# EasyEDA Pro project LED显示屏驱动.eprj

# Schematic Schematic1
Create Date: 2022-10-27; Project Name: LED显示屏驱动; Schematic Name: Schematic1; Update Date: 2022-11-05
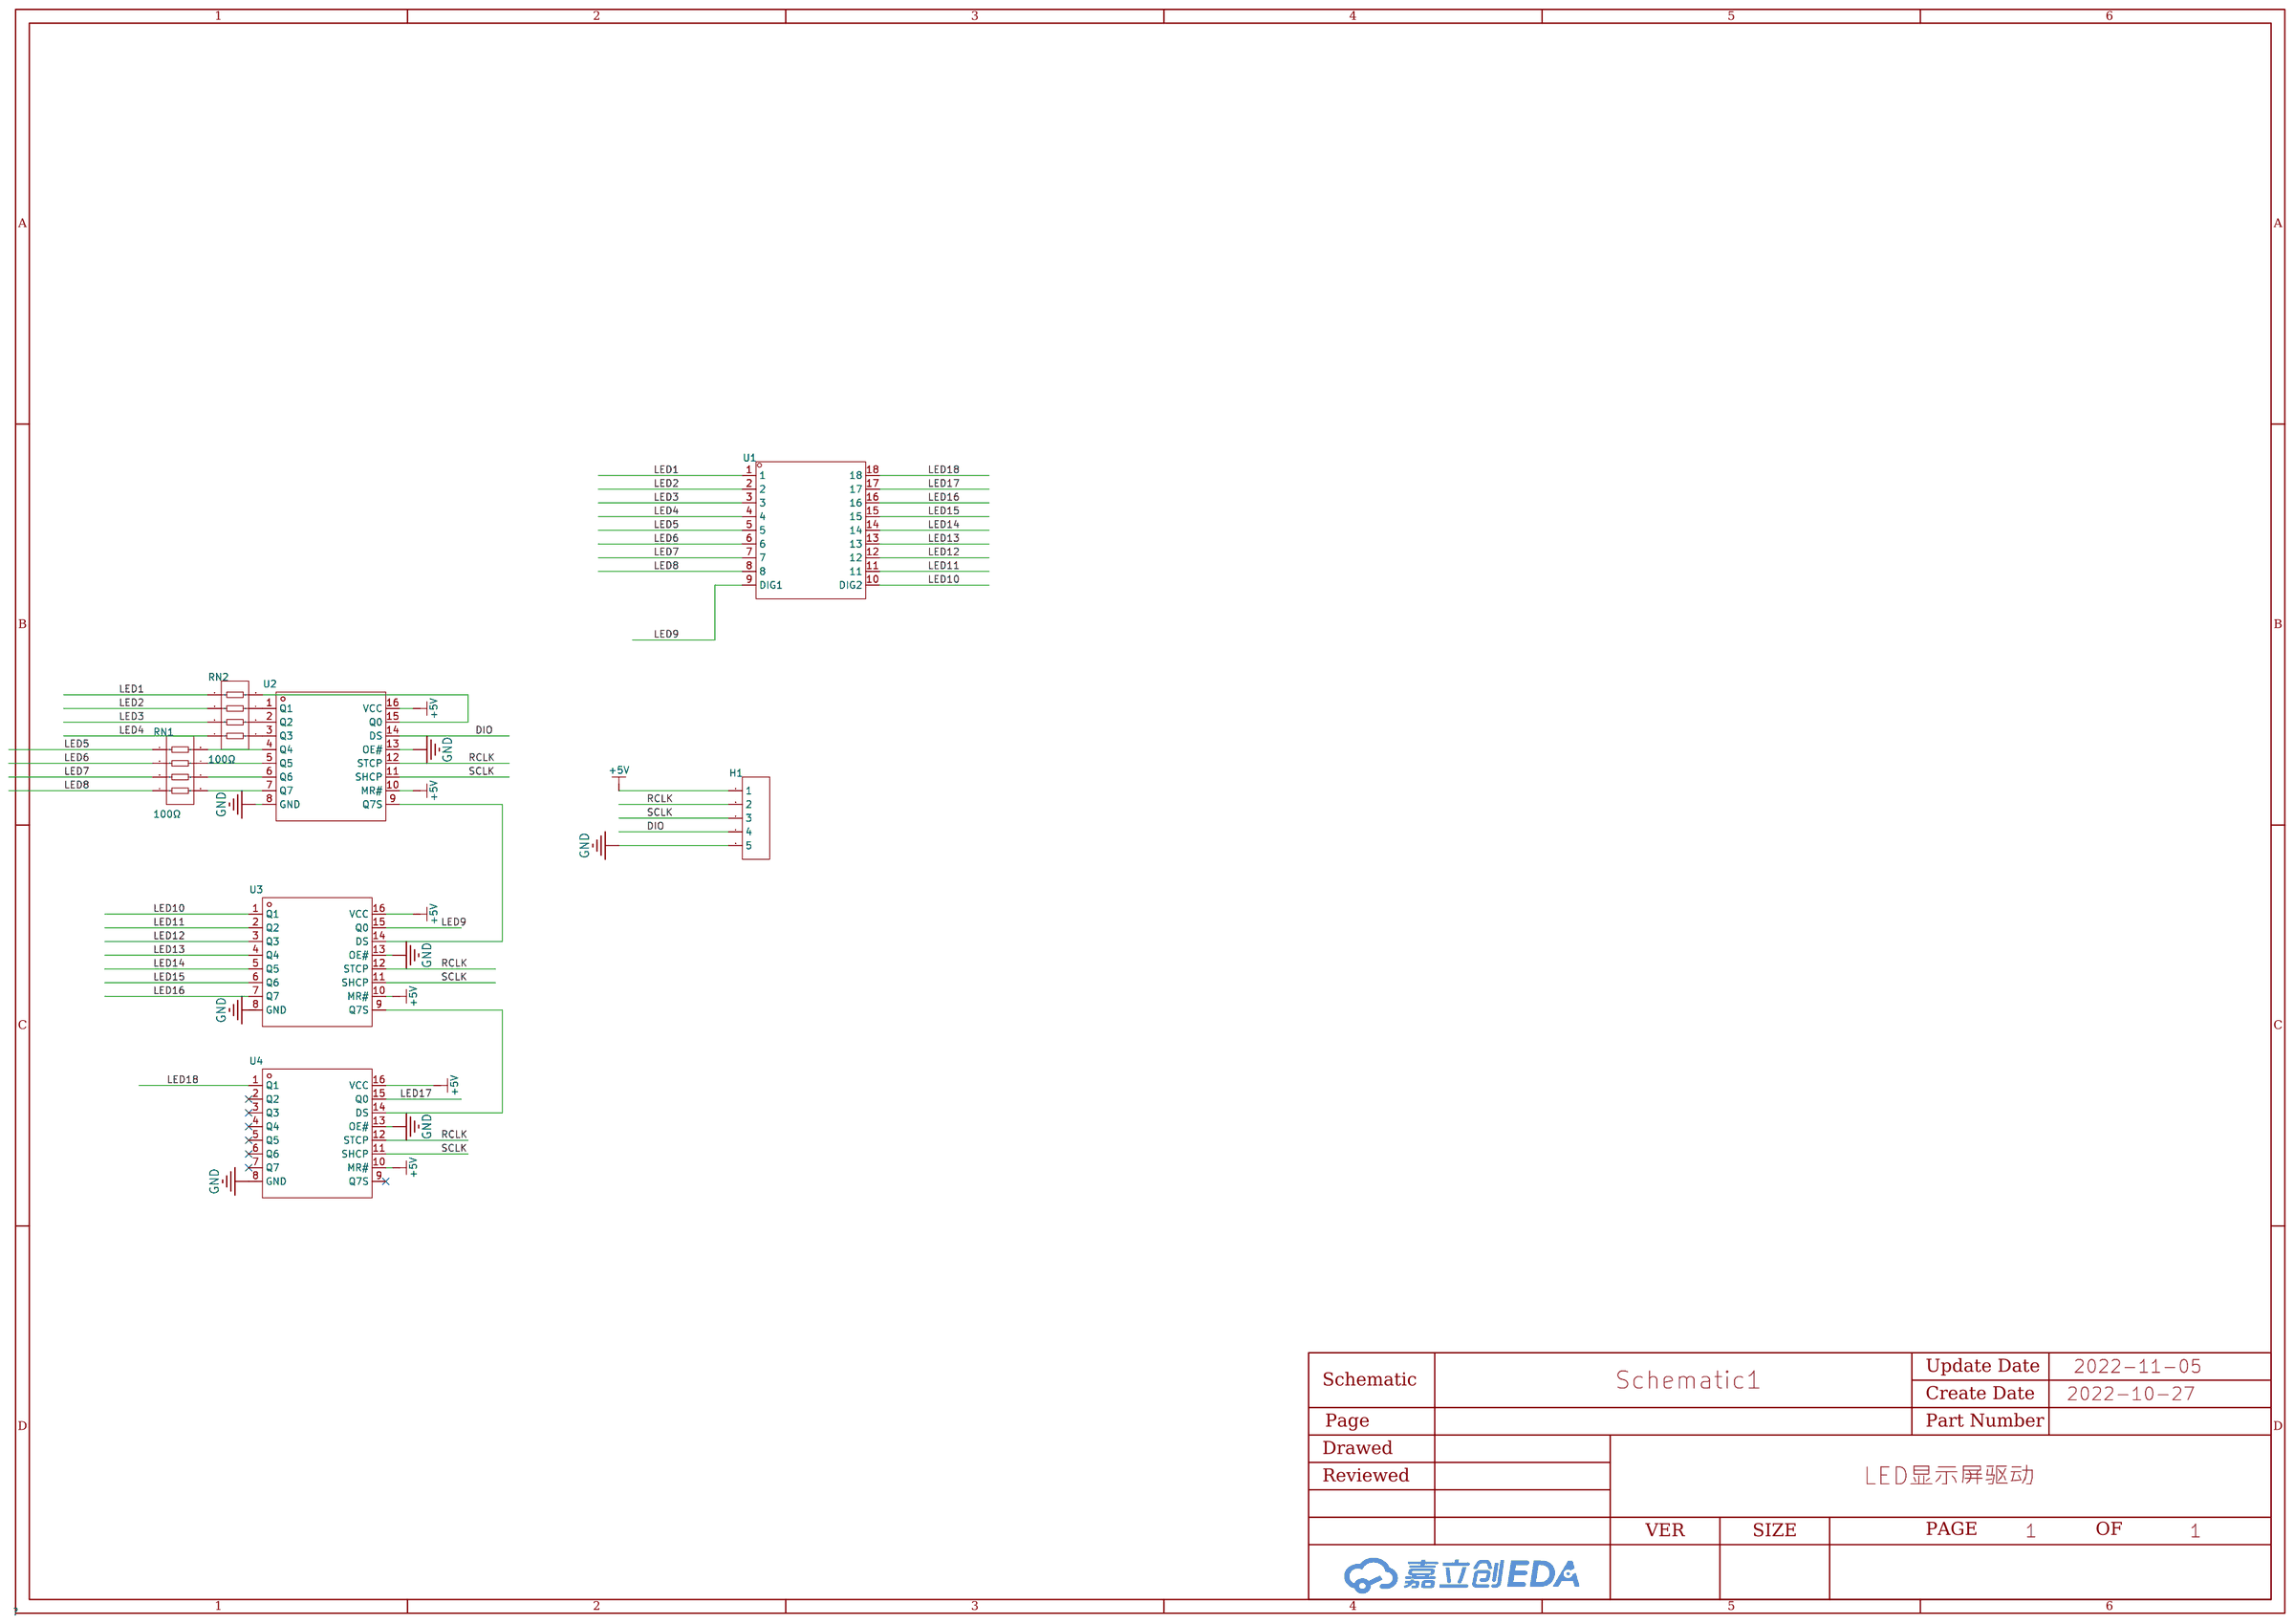
[diagram p0: schematic sheet]

## Parts
H1  2.54-1*5P母  [HDR-TH_5P-P2.54-V-F]
RN1  100Ω  [RES-ARRAY-SMD_0603-8P-L3.2-W1.6]
RN2  100Ω  [RES-ARRAY-SMD_0603-8P-L3.2-W1.6]
U1  TOD-6281AMA-B4  [LED-SEG-TH_18P-L94.0-W36.0-P2.54-S30.5-BL]
U2  74HC595S16-13  [SOIC-16_L10.8-W4.5-P1.27-LS6.8-BL]
U3  74HC595S16-13  [SOIC-16_L10.8-W4.5-P1.27-LS6.8-BL]
U4  74HC595S16-13  [SOIC-16_L10.8-W4.5-P1.27-LS6.8-BL]

## Library data of the parts
H1 = 2.54-1*5P母: 间距:2.54mm;总孔位数:5;排数:1;插孔结构:1x5P;行距:-;安装类型:直插;塑高:-;触头材质:-;触头镀层:-;; LCSC Part Name: 2.54mm 1x5P; Supplier Part: C50950; Manufacturer: BOOMELE(博穆精密); Supplier Footprint: 直插,P=2.54mm; JLCPCB Part Class: Extended Part; Datasheet: https://atta.szlcsc.com/upload/public/pdf/source/20151109/1457707571406.pdf; Supplier: LCSC; Pitch: 2.54mm; Number of Holes: 5; Number of Rows: 1; Holes Structure: 1x5P; Mounting Type: 直插
RN1 RN2 = 4D03WAJ0914T5E: 阻值:910kΩ;精度:±5%;单个元件功率:100mW;温度系数:±200ppm/℃;电阻器数:4;引脚数:8;; LCSC Part Name: 910kΩ ±5%; Supplier Part: C2769791; Manufacturer: UNI-ROYAL(厚声); Supplier Footprint: 0603x4; JLCPCB Part Class: Extended Part; Datasheet: https://atta.szlcsc.com/upload/public/pdf/source/20210330/C2758625_90D19EEA9B8C23AA9BAF71D52BD1DB3E.pdf; Supplier: LCSC; Tolerance: ±5%; Power(Watts): 100mW; Temperature Coefficient: ±200ppm/℃; Number of Resistors: 4; Number of Pins: 8
U1 = TOD-6281AMA-B4: 数码管位数:-;数码管的显示尺寸:-;电路连线类型:-;照明颜色:-;主波长/色坐标:-;; LCSC Part Name: LED显示模组 热水器屏 西班牙文; Supplier Part: C344208; Manufacturer: OASIS(李洲); Supplier Footprint: 插件; JLCPCB Part Class: Extended Part; Datasheet: https://atta.szlcsc.com/upload/public/pdf/source/20181211/C344208_A72DA94DC7576A39C0CC14E553CCA279.pdf; Supplier: LCSC
U2-U4 = 74HC595S16-13: 逻辑电路的归属系列:74HC;逻辑类型:移位寄存器;输出类型:三态;功能:串行至并行, 串行;工作电压:2V~6V;; Supplier Part: C129565; Manufacturer: DIODES(美台); Supplier Footprint: SOIC-16_150mil; JLCPCB Part Class: Extended Part; Datasheet: https://atta.szlcsc.com/upload/public/pdf/source/20170914/C129565_1505360072373968291.pdf; Supplier: LCSC; Series: 74HC; Logic Type: 移位寄存器; Output Type: 三态; Function: 串行至并行, 串行; Voltage - Supply: 2V~6V; Operating Temperature: -40℃~+125℃

## Nets
+5V: H1.1 U2.10(MR#) U2.16(VCC) U3.10(MR#) U3.16(VCC) U4.10(MR#) U4.16(VCC)
GND: H1.5 U2.8(GND) U2.13(OE#) U3.8(GND) U3.13(OE#) U4.8(GND) U4.13(OE#)
DIO: H1.4 U2.14(DS)
LED1: RN2.1 U1.1
LED2: RN2.2 U1.2
LED3: RN2.3 U1.3
LED4: RN2.4 U1.4
LED5: RN1.1 U1.5
LED6: RN1.2 U1.6
LED7: RN1.3 U1.7
LED8: RN1.4 U1.8
LED9: U1.9(DIG1) U3.15(Q0)
LED10: U1.10(DIG2) U3.1(Q1)
LED11: U1.11 U3.2(Q2)
LED12: U1.12 U3.3(Q3)
LED13: U1.13 U3.4(Q4)
LED14: U1.14 U3.5(Q5)
LED15: U1.15 U3.6(Q6)
LED16: U1.16 U3.7(Q7)
LED17: U1.17 U4.15(Q0)
LED18: U1.18 U4.1(Q1)
RCLK: H1.2 U2.12(STCP) U3.12(STCP) U4.12(STCP)
SCLK: H1.3 U2.11(SHCP) U3.11(SHCP) U4.11(SHCP)
$1N1758: U2.9(Q7S) U3.14(DS)
$1N5390: RN1.6 U2.6(Q6)
$1N5391: RN1.7 U2.5(Q5)
$1N5392: RN1.8 U2.4(Q4)
$1N5393: RN1.5 U2.7(Q7)
$1N5592: RN2.6 U2.2(Q2)
$1N5593: RN2.7 U2.1(Q1)
$1N5594: RN2.5 U2.3(Q3)
$1N5595: RN2.8 U2.15(Q0)
$1N6069: U3.9(Q7S) U4.14(DS)

Not connected (* = marked no-connect by the designer): U4 2(Q2)* 3(Q3)* 4(Q4)* 5(Q5)* 6(Q6)* 7(Q7)* 9(Q7S)*

# Board PCB1
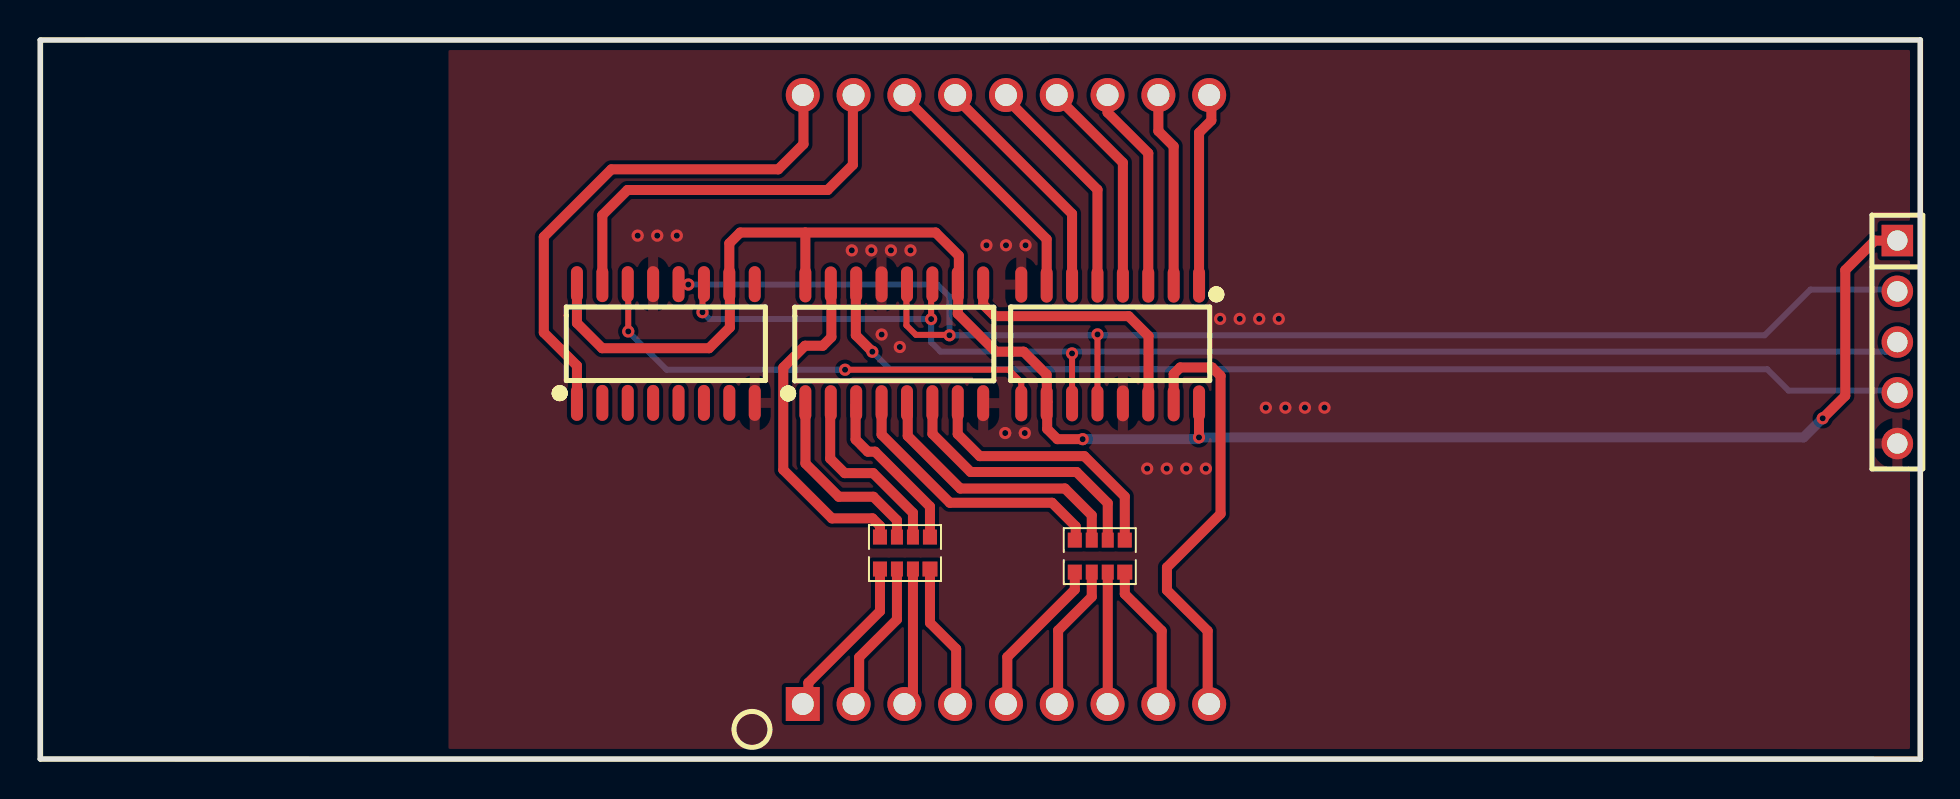
[diagram p1: board, top side]
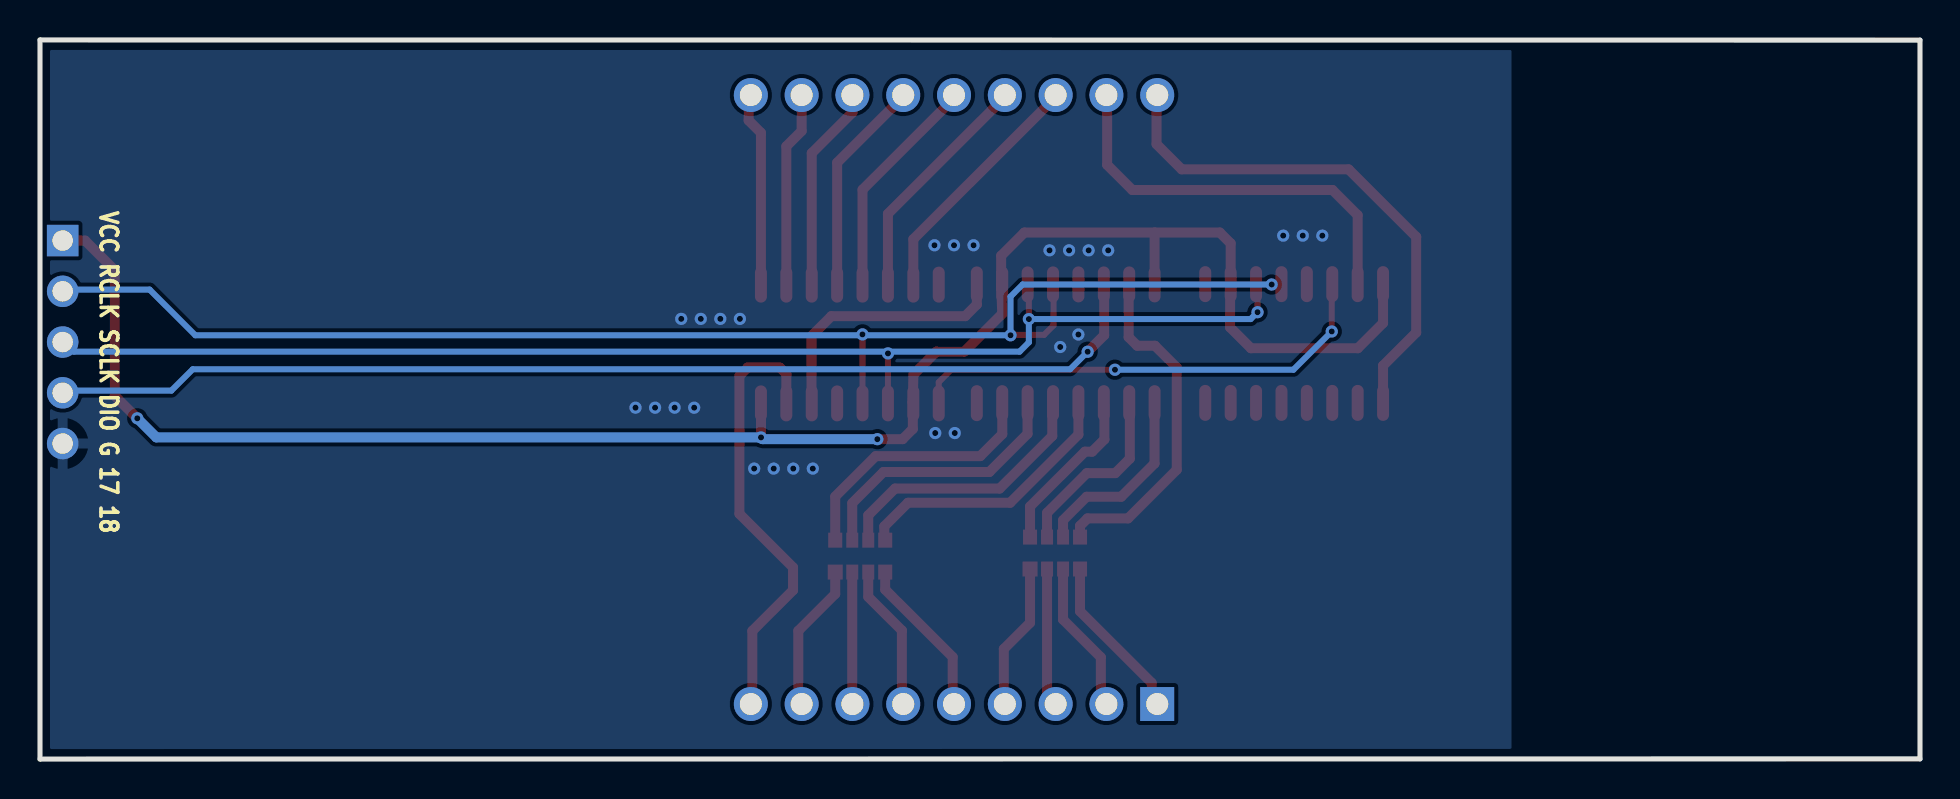
[diagram p2: board, bottom side, seen from below]

Outline 94 x 35.99 mm; copper layers: Top Layer, Bottom Layer. Coordinates in mm from the lower left corner of the outline.
Outline path: 0,0.01 0,35.98 94,35.99 94,0 0,0.01
Stack: Top Layer 0.035mm / 介电1 1.51mm FR4 er 4.5 / Bottom Layer 0.035mm

## Design rules (mm)
spacing Common (default): track to track 0.152, other pairs 0.152 to 0.3
track width Common (default): min 0.127, default 0.5, max 2.54
differential pair Common (default): width min 0.127, default 0.254, max 2.54; gap min 0.152, default 0.152
via Common (default): diameter min 0.5, default 0.61, max 10; hole min 0.3, default 0.305, max 6

## Placement (name value [footprint] x y rotation side)
H1  2.54-1*5P母  [HDR-TH_5P-P2.54-V-F]  92.87 20.87 270 top
RN1  100Ω  [RES-ARRAY-SMD_0603-8P-L3.2-W1.6]  52.99 10.16 90 top
RN2  100Ω  [RES-ARRAY-SMD_0603-8P-L3.2-W1.6]  43.25 10.31 90 top
U1  TOD-6281AMA-B4  [LED-SEG-TH_18P-L94.0-W36.0-P2.54-S30.5-BL]  48.3 17.99 0 top
U2  74HC595S16-13  [SOIC-16_L10.8-W4.5-P1.27-LS6.8-BL]  42.72 20.78 0 top
U3  74HC595S16-13  [SOIC-16_L10.8-W4.5-P1.27-LS6.8-BL]  53.51 20.77 180 top
U4  74HC595S16-13  [SOIC-16_L10.8-W4.5-P1.27-LS6.8-BL]  31.29 20.8 0 top

## Footprints (pads in the part's own frame, mm; a bottom-side part is the same pattern mirrored in y, then rotated)
HDR-TH_5P-P2.54-V-F
  rect 1.575x1.575 hole 1.02: 1(-5.08,0)
  round 1.575 hole 1.02: 2(-2.54,0) 3(0,0) 4(2.54,0) 5(5.08,0)
LED-SEG-TH_18P-L94.0-W36.0-P2.54-S30.5-BL
  rect 1.7x1.7 hole 1.1: 1(-10.16,-15.24)
  round 1.7 hole 1.1: 2(-7.62,-15.24) 3(-5.08,-15.24) 4(-2.54,-15.24) 5(0,-15.24) 6(2.54,-15.24) 7(5.08,-15.24) 8(7.62,-15.24) 9(10.16,-15.24) 10(10.16,15.24) 11(7.62,15.24) 12(5.08,15.24) 13(2.54,15.24) 14(0,15.24) 15(-2.54,15.24) 16(-5.08,15.24) 17(-7.62,15.24) 18(-10.16,15.24)
RES-ARRAY-SMD_0603-8P-L3.2-W1.6
  rect 0.75x0.701 smd: 1(-0.8,1.25) 5(0.8,-1.25) 8(0.8,1.25)
  rect 0.75x0.6 smd: 2(-0.8,0.402) 3(-0.8,-0.399) 6(0.8,-0.399) 7(0.8,0.402)
  rect 0.75x0.75 smd: 4(-0.8,-1.25)
SOIC-16_L10.8-W4.5-P1.27-LS6.8-BL
  oval 0.6x1.801 smd: 1(-4.445,-2.972) 2(-3.175,-2.972) 3(-1.905,-2.972) 4(-0.635,-2.972) 5(0.635,-2.972) 6(1.905,-2.972) 7(3.175,-2.972) 8(4.445,-2.972) 9(4.445,2.972) 10(3.175,2.972) 11(1.905,2.972) 12(0.635,2.972) 13(-0.635,2.972) 14(-1.905,2.972) 15(-3.175,2.972) 16(-4.445,2.972)

## Nets
As in the schematic.

Pads without a net: U4 2 3 4 5 6 7 9

## Via types
v1: diameter 0.61, hole 0.305, Top Layer to Bottom Layer, 38 vias

## Routing (per net, layer and track width the routed paths; a pad name or vN(x,y) marks a point on that pad's centre or on a via; arc(x,y) is an arc through that point)
+5V: length 93.2
  Top Layer w0.5: 50.36,17.88 50.36,17.88 50.36,17.84 ; 50.36,17.88 50.36,17.84 ; 50.36,17.88 50.35,17.89 ; 50.36,17.88 50.33,19.24 49.19,20.39 47.79,20.39 45.89,22.29 45.94,23.76 ; 50.36,17.84 50.36,16.52 50.87,16.01 v1(52.14,16.01) ; 45.94,23.76 45.94,23.56 ; 45.94,23.76 45.94,25.19 44.78,26.35 38.27,26.35 U2.16 ; v1(89.14,17.05) 90.27,18.18 90.27,24.47 91.75,25.95 92.74,25.95 ; 38.25,26.35 35.01,26.35 34.47,25.81 U4.10 ; U4.16 26.85,21.82 28.11,20.56 33.45,20.56 34.5,21.6 34.5,23.7 ; v1(57.95,16.1) 57.95,17.87
  Bottom Layer w0.5: v1(52.14,16.01) 57.86,16.01 v1(57.95,16.1) 88.18,16.1 v1(89.14,17.05)
GND:
  vias: v1(29.89,26.2) v1(30.86,26.2) v1(31.84,26.2) v1(40.59,25.46) v1(41.57,25.46) v1(42.08,21.25) v1(42.55,25.46) v1(42.99,20.62) v1(43.53,25.46) v1(47.32,25.72) v1(48.26,16.32) v1(48.3,25.72) v1(49.28,25.72) v1(49.24,16.32) v1(55.36,14.54) v1(56.34,14.54) v1(57.32,14.54) v1(58.29,14.54) v1(59.01,22.03) v1(59.99,22.03) v1(60.96,22.03) v1(61.29,17.59) v1(61.94,22.03) v1(62.27,17.59) v1(63.25,17.59) v1(64.23,17.59)
DIO: length 55.7
  Top Layer w0.5: 40.79,23.55 40.79,21.21 v1(41.62,20.39)
  Bottom Layer w0.3: 92.94,18.4 92.9,18.44 87.43,18.44 86.36,19.51 42.5,19.51 v1(41.62,20.39)
LED1: length 8
  Top Layer w0.5: RN2.1 42,7.4 38.42,3.82 38.42,3.04
LED2: length 7.5
  Top Layer w0.5: 40.76,2.85 40.96,3.05 40.96,5.09 42.85,6.98 42.85,9.51
LED3: length 6.8
  Top Layer w0.5: 43.23,2.9 43.65,3.32 RN2.3
LED4: length 7.5
  Top Layer w0.5: 45.81,2.58 45.81,5.51 44.5,6.82 RN2.4
LED5: length 7.9
  Top Layer w0.5: RN1.1 51.74,8.48 48.37,5.11 48.37,2.85
LED6: length 7.1
  Top Layer w0.5: RN1.2 52.59,8.12 50.91,6.44 50.91,2.97
LED7: length 6.6
  Top Layer w0.5: RN1.3 53.39,2.77 53.35,2.73
LED8: length 7.7
  Top Layer w0.5: 54.24,9.36 54.24,8.26 56.09,6.42 56.09,2.47
LED9: length 22.7
  Top Layer w0.5: 58.39,2.6 58.39,6.41 56.35,8.45 56.35,9.59 59.03,12.27 59.03,19.18 58.61,19.6 57.02,19.6 56.69,19.27 U3.15
LED10: length 9.9
  Top Layer w0.5: 58.57,33.4 58.57,31.96 57.96,31.35 U3.1
LED11: length 9.9
  Top Layer w0.5: 56.68,23.61 56.68,30.67 55.92,31.43 U1.11
LED12: length 10.3
  Top Layer w0.5: U3.3 55.42,30.33 53.38,32.36 U1.12
LED13: length 10.7
  Top Layer w0.5: 50.92,33.07 54.15,29.85 U3.4
LED14: length 11.1
  Top Layer w0.5: 48.36,33.01 52.88,28.5 U3.5
LED15: length 11.7
  Top Layer w0.5: U3.6 51.61,27.29 45.86,33.03
LED16: length 12.2
  Top Layer w0.5: 43.32,33.03 50.34,26.02 U3.7
LED17: length 20.5
  Top Layer w0.5: 40.64,33.2 40.64,29.74 39.38,28.48 29.38,28.48 28.12,27.22 U4.15
LED18: length 26.2
  Top Layer w0.5: U4.1 26.85,19.69 25.19,21.35 25.19,26.14 28.57,29.52 36.91,29.52 38.17,30.78 38.17,33.1
RCLK: length 71.7
  Top Layer w0.3: 43.32,23.61 43.32,21.71 43.8,21.23 45.5,21.23 v1(45.48,21.21) ; v1(52.88,21.25) 52.88,21.16 52.88,21.15 U3.12 ; 32.23,23.7 32.28,23.75 v1(32.42,23.75)
  Bottom Layer w0.3: v1(32.42,23.75) 44.87,23.75 45.48,23.15 v1(45.48,21.21) 86.24,21.21 88.52,23.5 92.75,23.5 92.96,23.29
SCLK: length 66.4
  Top Layer w0.3: 33.2,23.22 33.13,23.14 v1(33.13,22.36) ; 44.63,23.63 44.56,23.57 v1(44.56,22.02) ; v1(51.6,20.3) 51.61,20.3 U3.11
  Bottom Layer w0.3: 51.61,20.33 51.6,20.32 v1(51.6,20.3) ; v1(33.13,22.36) 33.47,22.02 v1(44.56,22.02) 44.56,20.86 45.02,20.39 92.31,20.39 92.76,20.84
$1N1758: length 13.2
  Top Layer w0.5: U2.9 47.16,22.75 47.74,22.17 54.44,22.17 55.43,21.17 55.43,17.85
$1N5390: length 13.4
  Top Layer w0.5: 44.62,17.59 44.62,16.28 46.53,14.37 51.83,14.37 53.39,12.81 53.39,10.96
$1N5391: length 13.8
  Top Layer w0.5: 52.59,10.96 52.59,12.2 51.25,13.54 46.02,13.54 43.39,16.17 43.39,17.85
$1N5392: length 13.9
  Top Layer w0.5: 51.79,10.91 51.79,11.64 50.61,12.83 45.49,12.83 42.08,16.24 42.08,17.81
$1N5393: length 13.2
  Top Layer w0.5: 45.89,17.63 45.89,16.26 46.99,15.16 52.22,15.16 54.24,13.14 54.24,10.96
$1N5592: length 9
  Top Layer w0.5: 39.51,17.56 39.51,15.04 40.24,14.31 41.66,14.31 43.65,12.32 RN2.6
$1N5593: length 9.4
  Top Layer w0.5: 42.85,11.11 42.85,11.95 41.67,13.13 39.94,13.13 38.27,14.79 38.27,17.56
$1N5594: length 8.3
  Top Layer w0.5: RN2.5 44.5,12.64 41.75,15.39 41.39,15.39 40.78,16 40.78,17.68
$1N5595: length 17.2
  Top Layer w0.5: 39.57,23.59 39.57,21.12 39.14,20.69 38.25,20.69 37.17,19.6 37.17,14.48 39.6,12.05 41.63,12.05 42,11.67 RN2.8
$1N6069: length 24.1
  Top Layer w0.3: U3.9 49.07,18.86 48.44,19.49 v1(40.25,19.49) ; 29.36,23.75 29.41,23.7 v1(29.41,21.4)
  Bottom Layer w0.3: v1(29.41,21.4) 31.33,19.49 v1(40.25,19.49)

## Copper pours and planes (outline as drawn; the poured copper is in the pictures)
GND on Top Layer: 20.42,39.03 95.67,39.03 95.67,-3.26 20.42,-3.26
GND on Bottom Layer: 20.42,39.03 94.52,39.03 94.52,-3.26 20.42,-3.26

## Text on the board
Bottom Silkscreen Layer: VCC RCLK SCLK DIO G 17 18
